# Altium schematic sheet VNA_6.SchDoc: VNA
size 409 x 289 mm; Origin: Eagle; OriginPath: C:\Users\Ground Lab\Desktop\LibreVNA\Hardware\Eagle\VNA.sch; OriginSheet: 7; OriginDescription: Port 2; Date: 04.05.2025 20:03:37; SheetNumber: 7; GateName_1: G$1; SymbolName_1: A3L-LOC; LibraryName: VNA; DeviceSetName: A3L-LOC; Sheet: Sheet:
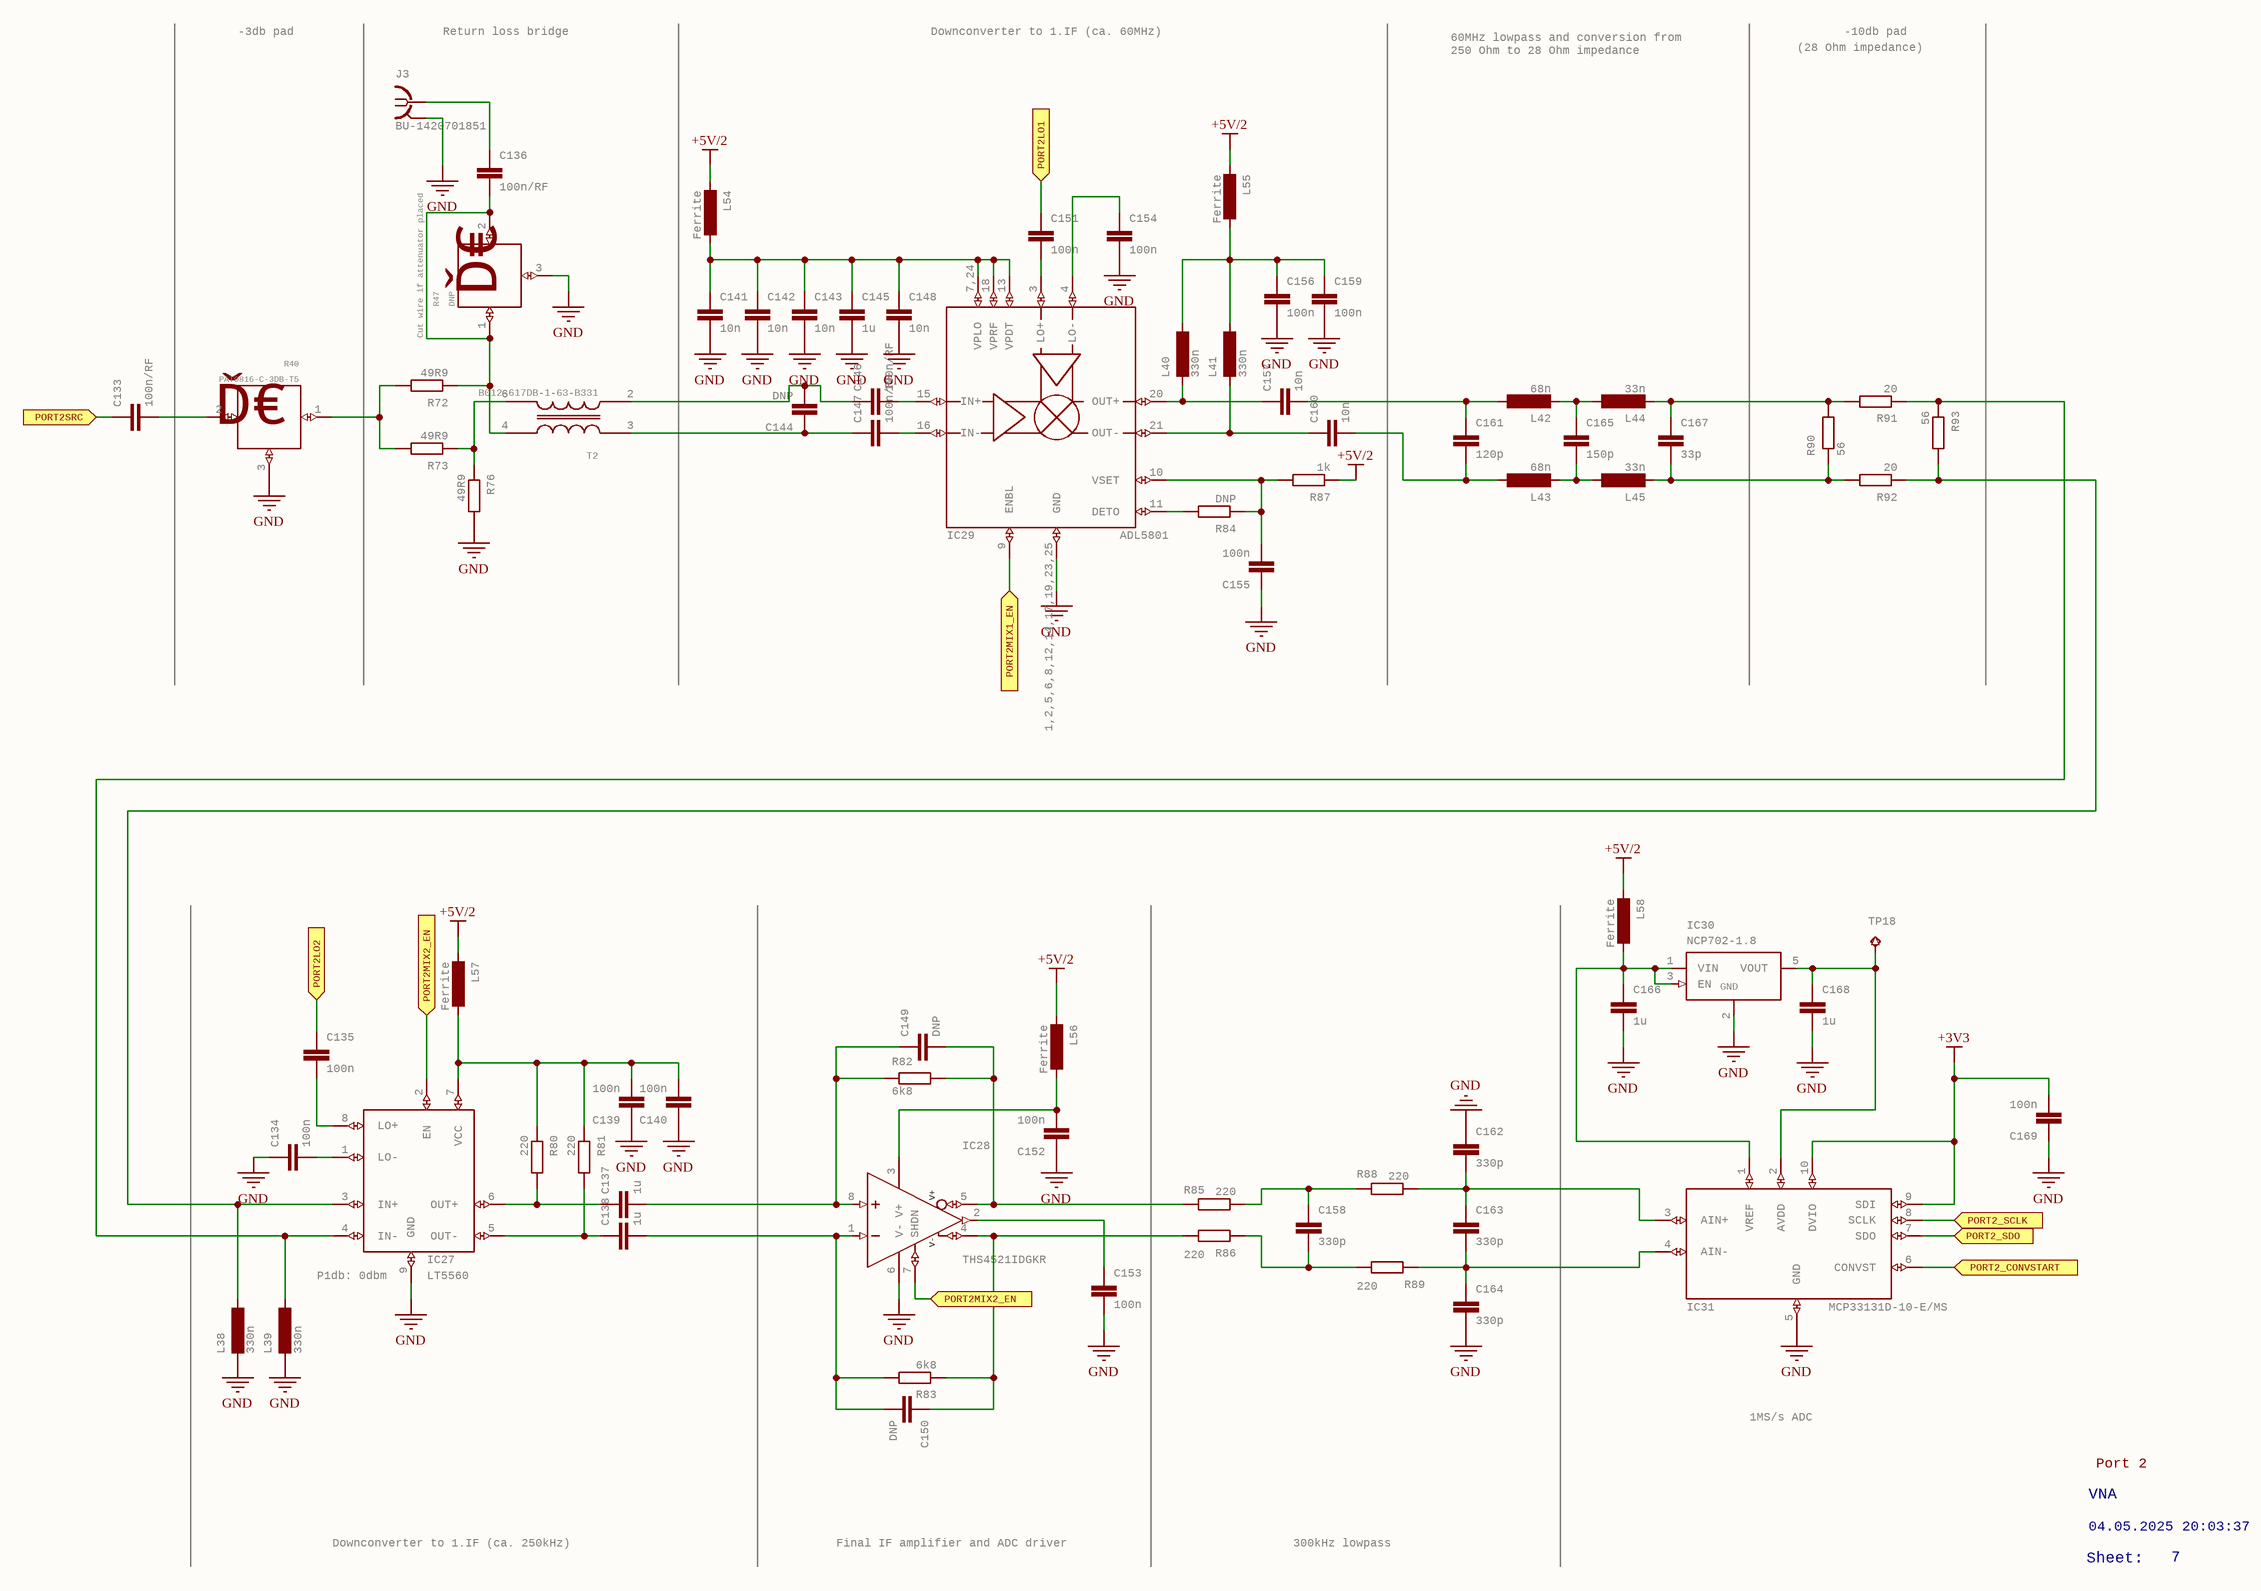
[diagram p0: VNA_6.SchDoc]

## Parts
C133  100n/RF  [C0402]
C134  100n  [C0402]
C135  100n  [C0402]
C136  100n/RF  [C0402]
C137  1u  [C0402]
C138  1u  [C0402]
C139  100n  [C0402]
C140  100n  [C0402]
C141  10n  [C0402]
C142  10n  [C0402]
C143  10n  [C0402]
C144  DNP  [C0402]
C145  1u  [C0402]
C146  100n/RF  [C0402]
C147  100n/RF  [C0402]
C148  10n  [C0402]
C149  DNP  [C0402]
C150  DNP  [C0402]
C151  100n  [C0402]
C152  100n  [C0402]
C153  100n  [C0402]
C154  100n  [C0402]
C155  100n  [C0402]
C156  100n  [C0402]
C157  10n  [C0402]
C158  330p  [C0402]
C159  100n  [C0402]
C160  10n  [C0402]
C161  120p  [C0402]
C162  330p  [C0402]
C163  330p  [C0402]
C164  330p  [C0402]
C165  150p  [C0402]
C166  1u  [C0402]
C167  33p  [C0402]
C168  1u  [C0402]
C169  100n  [C0402]
IC27  LT5560  [SON50P300X300X80-9T165X238]
IC28  THS4521IDGKR  [SOP65P490X110-8N]
IC29  ADL5801  [QFN50P400X400X100-25T250N]
IC30  NCP702-1.8  [SOT95P240X110-5]
IC31  MCP33131D-10-E/MS  [SOP50P490X110-10N]
J3  BU-1420701851  [BU-1420701851]
L38  330n  [L0402]
L39  330n  [L0402]
L40  330n  [L0402]
L41  330n  [L0402]
L42  68n  [L0402]
L43  68n  [L0402]
L44  33n  [L0402]
L45  33n  [L0402]
L54  Ferrite  [R0402]
L55  Ferrite  [R0402]
L56  Ferrite  [R0402]
L57  Ferrite  [R0402]
L58  Ferrite  [R0402]
R40  PAT0816-C-3DB-T5  [PAT0816]
R47  DNP  [PAT0816]
R72  49R9  [R0402]
R73  49R9  [R0402]
R76  49R9  [R0402]
R80  220  [R0402]
R81  220  [R0402]
R82  6k8  [R0402]
R83  6k8  [R0402]
R84  DNP  [R0402]
R85  220  [R0402]
R86  220  [R0402]
R87  1k  [R0402]
R88  220  [R0402]
R89  220  [R0402]
R90  56  [R0402]
R91  20  [R0402]
R92  20  [R0402]
R93  56  [R0402]
T2  B012-617DB-1-63-B331  [EASTEVER_BALUN]
TP18  TPB1,27  [B1,27]  (value not drawn)

## Ports
PORT2_CONVSTART (in), PORT2_SCLK (in), PORT2_SDO (in), PORT2LO1 (in), PORT2LO2 (in), PORT2MIX1_EN (in), PORT2MIX2_EN (in), PORT2SRC (in)

## Nets
+3V3: C169.2 IC31.9(SDI) IC31.10(DVIO)
+5V/2: L54.2 L55.2 L56.2 L57.2 L58.2 R87.1
GND: C134.1 C139.1 C140.1 C141.2 C142.2 C143.2 C145.2 C148.2 C152.1 C153.2 C154.2 C155.1 C156.2 C159.2 C162.1 C164.2 C166.2 C168.2 C169.1 IC27.9(GND) IC28.6(V-) IC29.1,2,5,6,8,12,14,17,19,23,25(GND) IC30.2(GND) IC31.5(GND) J3.G@1-4 L38.2 L39.2 R40.3(GND) R47.3(GND) R76.2
PORT2_CONVSTART: IC31.6(CONVST) ; port PORT2_CONVSTART
PORT2_SCLK: IC31.8(SCLK) ; port PORT2_SCLK
PORT2_SDO: IC31.7(SDO) ; port PORT2_SDO
PORT2LO1: C151.1 ; port PORT2LO1
PORT2LO2: C135.1 ; port PORT2LO2
PORT2MIX1_EN: IC29.9(ENBL) ; port PORT2MIX1_EN
PORT2MIX2_EN: IC27.2(EN) IC28.7(SHDN) ; port PORT2MIX2_EN
PORT2SRC: C133.1 ; port PORT2SRC
NetC133_2: C133.2 R40.2(OUT)
NetC134_2: C134.2 IC27.1(LO-)
NetC135_2: C135.2 IC27.8(LO+)
NetC136_1: C136.1 J3.1
NetC136_2: C136.2 R47.1(IN) R47.2(OUT) R72.1 T2.4(OUT+)
NetC137_1: C137.1 IC27.6(OUT+) R80.2
NetC137_2: C137.2 C149.1 IC28.8(+IN) R82.1
NetC138_1: C138.1 IC27.5(OUT-) R81.2
NetC138_2: C138.2 C150.2 IC28.1(-IN) R83.2
NetC139_2: C139.2 C140.2 IC27.7(VCC) L57.1 R80.1 R81.1
NetC141_1: C141.1 C142.1 C143.1 C145.1 C148.1 IC29.7,24(VPLO) IC29.13(VPDT) IC29.18(VPRF) L54.1
NetC144_1: C144.1 C147.1 T2.3(IN+)
NetC144_2: C144.2 C146.1 T2.2(IN-)
NetC146_2: C146.2 IC29.15(IN+)
NetC147_2: C147.2 IC29.16(IN-)
NetC149_2: C149.2 IC28.5(-OUT) R82.2 R85.2
NetC150_1: C150.1 IC28.4(+OUT) R83.1 R86.2
NetC151_2: C151.2 IC29.3(LO+)
NetC152_2: C152.2 IC28.3(V+) L56.1
NetC153_1: C153.1 IC28.2(VOCM)
NetC154_1: C154.1 IC29.4(LO-)
NetC155_2: C155.2 IC29.10(VSET) R84.1 R87.2
NetC156_1: C156.1 C159.1 L40.1 L41.1 L55.1
NetC157_1: C157.1 IC29.20(OUT+) L40.2
NetC157_2: C157.2 C161.1 L42.1
NetC158_1: C158.1 R85.1 R88.2
NetC158_2: C158.2 R86.1 R89.2
NetC160_1: C160.1 IC29.21(OUT-) L41.2
NetC160_2: C160.2 C161.2 L43.1
NetC162_2: C162.2 C163.1 IC31.3(AIN+) R88.1
NetC163_2: C163.2 C164.1 IC31.4(AIN-) R89.1
NetC165_1: C165.1 L42.2 L44.1
NetC165_2: C165.2 L43.2 L45.1
NetC166_1: C166.1 IC30.1(VIN) IC30.3(EN) IC31.1(VREF) L58.1
NetC167_1: C167.1 L44.2 R90.2 R91.2
NetC167_2: C167.2 L45.2 R90.1 R92.2
NetC168_1: C168.1 IC30.5(VOUT) IC31.2(AVDD) TP18.TP
NetIC27_3: IC27.3(IN+) IC27.4(IN-) L38.1 L39.1 R91.1 R92.1 R93.1 R93.2
NetIC29_11: IC29.11(DETO) R84.2
NetR40_1: R40.1(IN) R72.2 R73.2
NetR73_1: R73.1 R76.1 T2.6(OUT-)

## Notes on the sheet
- -3db pad
- Return loss bridge
- Downconverter to 1.IF (ca. 60MHz)
- 60MHz lowpass and conversion from
  250 Ohm to 28 Ohm impedance
- (28 Ohm impedance)
- -10db pad
- Cut wire if attenuator placed
- (near IC27) P1db: 0dbm
- 1MS/s ADC
- VNA
- Port 2
- Downconverter to 1.IF (ca. 250kHz)
- Final IF amplifier and ADC driver
- 300kHz lowpass
- Sheet:
- 04.05.2025 20:03:37
- 7

## Library data of the parts
C133-C169 = C-EU*?:2C0402: CAPACITOR, European symbol; GateName_1: G$1; SymbolName_1: C-EU:1; DeviceName: C0402; LibraryName: VNA; DeviceSetName: C-EU*?:2
IC27 = LT5560: GateName_1: G$1; SymbolName_1: LT5560; LibraryName: VNA; DeviceSetName: LT5560
IC28 = THS4521IDGKR: GateName_1: G$1; SymbolName_1: OPAMPDIFF_SHDN; LibraryName: VNA; DeviceSetName: THS4521IDGKR; V+: V+; V-: V-
IC29 = ADL5801: GateName_1: G$1; SymbolName_1: ADL5801; LibraryName: VNA; DeviceSetName: ADL5801
IC30 = NCP702: GateName_1: G$1; SymbolName_1: VREG_EN; LibraryName: VNA; DeviceSetName: NCP702; GND: GND
IC31 = MCP33131D-10-E/MS: GateName_1: G$1; SymbolName_1: MCP33131D-10-E/MS; LibraryName: VNA; DeviceSetName: MCP33131D-10-E/MS
J3 = BU-1420701851: GateName_1: G$1; SymbolName_1: BNC-FGND; LibraryName: VNA; DeviceSetName: BU-1420701851
L38-L45 = INDUCTOR0402: GateName_1: G$1; SymbolName_1: L-EU:1; DeviceName: 0402; LibraryName: VNA; DeviceSetName: INDUCTOR
L54-L58 = FERRITE: GateName_1: G$1; SymbolName_1: L-EU:1; LibraryName: VNA; DeviceSetName: FERRITE
R40 R47 = PAT0816-C-3DB-T5: 3dB pad attenuator; GateName_1: G$1; SymbolName_1: ATTENUATOR_3PIN; LibraryName: VNA; DeviceSetName: PAT0816-C-3DB-T5; Ď€: Ď€
R72 R73 R76 R80-R93 = R-EU_R0402: RESISTOR, European symbol; GateName_1: G$1; SymbolName_1: R-EU; DeviceSetName: R-EU_; DeviceName: R0402; LibraryName: VNA
T2 = B012-617DB-1-63-B331: GateName_1: G$1; SymbolName_1: BALUN_1:1; LibraryName: VNA; DeviceSetName: B012-617DB-1-63-B331
TP18 = TPB1,27: Test pad; GateName_1: G$1; SymbolName_1: TP; DeviceName: B1,27; LibraryName: VNA; DeviceSetName: TP